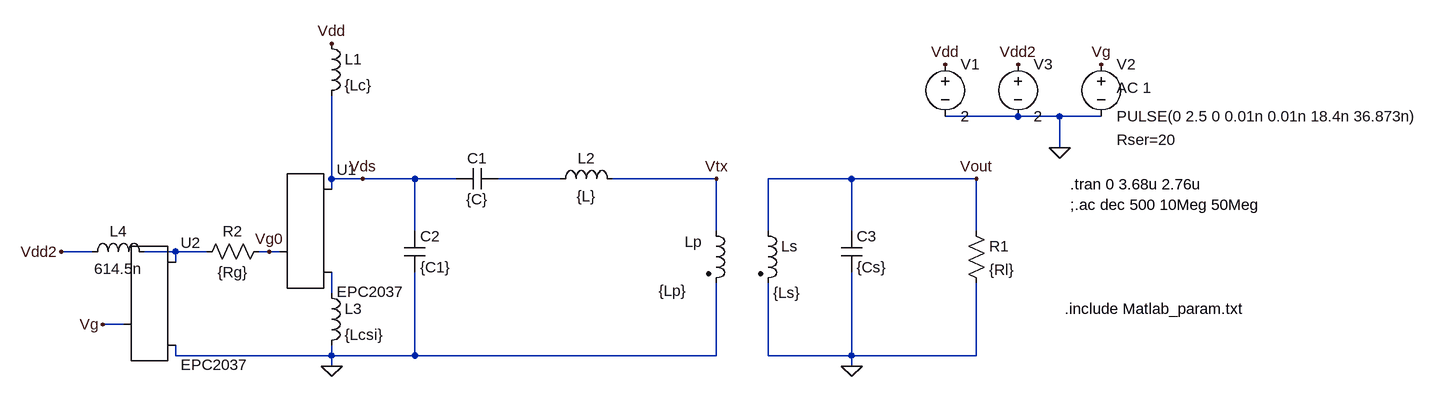
[diagram p0: schematic ClassE_ResGateDriver.asc]
ClassE_ResGateDriver.asc, the LTspice schematic file:
Version 4
SHEET 1 4112 680
WIRE 464 -512 352 -512
WIRE 528 -512 464 -512
WIRE 592 -512 528 -512
WIRE 528 -464 528 -512
WIRE -592 -416 -592 -544
WIRE -544 -416 -592 -416
WIRE -464 -416 -544 -416
WIRE -400 -416 -464 -416
WIRE -240 -416 -336 -416
WIRE 0 -416 -160 -416
WIRE 208 -416 80 -416
WIRE 400 -416 208 -416
WIRE -592 -400 -592 -416
WIRE -464 -336 -464 -416
WIRE 0 -336 0 -416
WIRE 80 -336 80 -416
WIRE 208 -336 208 -416
WIRE 400 -336 400 -416
WIRE -960 -304 -1008 -304
WIRE -832 -304 -880 -304
WIRE -784 -304 -832 -304
WIRE -688 -304 -704 -304
WIRE -672 -304 -688 -304
WIRE -832 -288 -832 -304
WIRE -592 -240 -592 -272
WIRE -912 -192 -944 -192
WIRE -832 -144 -832 -160
WIRE -592 -144 -592 -160
WIRE -592 -144 -832 -144
WIRE -464 -144 -464 -272
WIRE -464 -144 -592 -144
WIRE 0 -144 0 -256
WIRE 0 -144 -464 -144
WIRE 80 -144 80 -256
WIRE 208 -144 208 -272
WIRE 208 -144 80 -144
WIRE 400 -144 400 -256
WIRE 400 -144 208 -144
WIRE -592 -128 -592 -144
WIRE 208 -128 208 -144
FLAG -1008 -304 Vdd2
FLAG -944 -192 Vg
FLAG 528 -464 0
FLAG 464 -592 Vdd2
FLAG 592 -592 Vg
FLAG -592 -624 Vdd
FLAG 0 -416 Vtx
FLAG -592 -128 0
FLAG 208 -128 0
FLAG 400 -416 Vout
FLAG -544 -416 Vds
FLAG -688 -304 Vg0
FLAG 352 -592 Vdd
SYMBOL res -688 -320 R90
WINDOW 0 0 56 VBottom 2
WINDOW 3 32 56 VTop 2
SYMATTR InstName R2
SYMATTR Value {Rg}
SYMBOL ind -976 -288 R270
WINDOW 0 32 56 VTop 2
WINDOW 3 5 56 VBottom 2
SYMATTR InstName L4
SYMATTR Value 614.5n
SYMBOL voltage 464 -608 R0
WINDOW 123 0 0 Left 0
WINDOW 39 0 0 Left 0
SYMATTR InstName V3
SYMATTR Value 2
SYMBOL voltage 592 -608 R0
WINDOW 123 24 52 Left 2
WINDOW 39 24 132 Left 2
SYMATTR Value2 AC 1
SYMATTR SpiceLine Rser=20
SYMATTR InstName V2
SYMATTR Value PULSE(0 2.5 0 0.01n 0.01n 18.4n 36.873n)
SYMBOL EPCGaN -672 -304 R0
SYMATTR InstName U1
SYMATTR Value EPC2037
SYMBOL ind -608 -640 R0
SYMATTR InstName L1
SYMATTR Value {Lc}
SYMATTR SpiceLine Rser=0.1
SYMBOL ind -256 -400 R270
WINDOW 0 32 56 VTop 2
WINDOW 3 5 56 VBottom 2
SYMATTR InstName L2
SYMATTR Value {L}
SYMATTR SpiceLine Rser=0.1
SYMBOL cap -336 -432 R90
WINDOW 0 0 32 VBottom 2
WINDOW 3 32 32 VTop 2
SYMATTR InstName C1
SYMATTR Value {C}
SYMATTR SpiceLine Rser=0.1
SYMBOL res 384 -352 R0
SYMATTR InstName R1
SYMATTR Value {Rl}
SYMBOL cap -480 -336 R0
SYMATTR InstName C2
SYMATTR Value {C1}
SYMATTR SpiceLine Rser=0.1
SYMBOL ind2 -16 -352 R0
WINDOW 0 -33 33 Left 2
WINDOW 3 -73 108 Left 2
SYMATTR InstName Lp
SYMATTR Value {Lp}
SYMATTR Type ind
SYMATTR SpiceLine Rser={Rp} Cpar={Cpp}
SYMBOL ind2 64 -352 R0
WINDOW 3 23 111 Left 2
SYMATTR Value {Ls}
SYMATTR InstName Ls
SYMATTR Type ind
SYMATTR SpiceLine Rser={Rs} Cpar={Cps}
SYMBOL cap 192 -336 R0
SYMATTR InstName C3
SYMATTR Value {Cs}
SYMBOL ind -608 -256 R0
SYMATTR InstName L3
SYMATTR Value {Lcsi}
SYMATTR SpiceLine Rser=0.1
SYMBOL EPCGaN -912 -192 R0
SYMATTR InstName U2
SYMATTR Value EPC2037
SYMBOL voltage 352 -608 R0
WINDOW 123 0 0 Left 0
WINDOW 39 0 0 Left 0
SYMATTR InstName V1
SYMATTR Value 2
TEXT 536 -216 Left 2 !.include Matlab_param.txt
TEXT 544 -408 Left 2 !.tran 0 3.68u 2.76u
TEXT 544 -376 Left 2 !;.ac dec 500 10Meg 50Meg

The netlist it stands for:
* ClassE_ResGateDriver.asc
R2 Vg0 N002 {Rg}
L4 Vdd2 N002 614.5n
V3 Vdd2 0 2
V2 Vg 0 PULSE(0 2.5 0 0.01n 0.01n 18.4n 36.873n) AC 1 Rser=20
XU1 Vg0 Vds N003 EPC2037
L1 Vdd Vds {Lc} Rser=0.1
L2 N001 Vtx {L} Rser=0.1
C1 N001 Vds {C} Rser=0.1
R1 Vout 0 {Rl}
C2 Vds 0 {C1} Rser=0.1
Lp Vtx 0 {Lp} Rser={Rp} Cpar={Cpp}
Ls Vout 0 {Ls} Rser={Rs} Cpar={Cps}
C3 Vout 0 {Cs}
L3 N003 0 {Lcsi} Rser=0.1
XU2 Vg N002 0 EPC2037
V1 Vdd 0 2
.include Matlab_param.txt
.tran 0 3.68u 2.76u
;.ac dec 500 10Meg 50Meg
.backanno
.end